# EAGLE board 000018 PGKB Rev 2.00 (EAGLE 9.6.2)
AUTHOR: Kallio Designs; DATE: 02.03.2019; PRODUCT_NUMBER: 000018; REVISION: 2.00; TITLE: PGKB
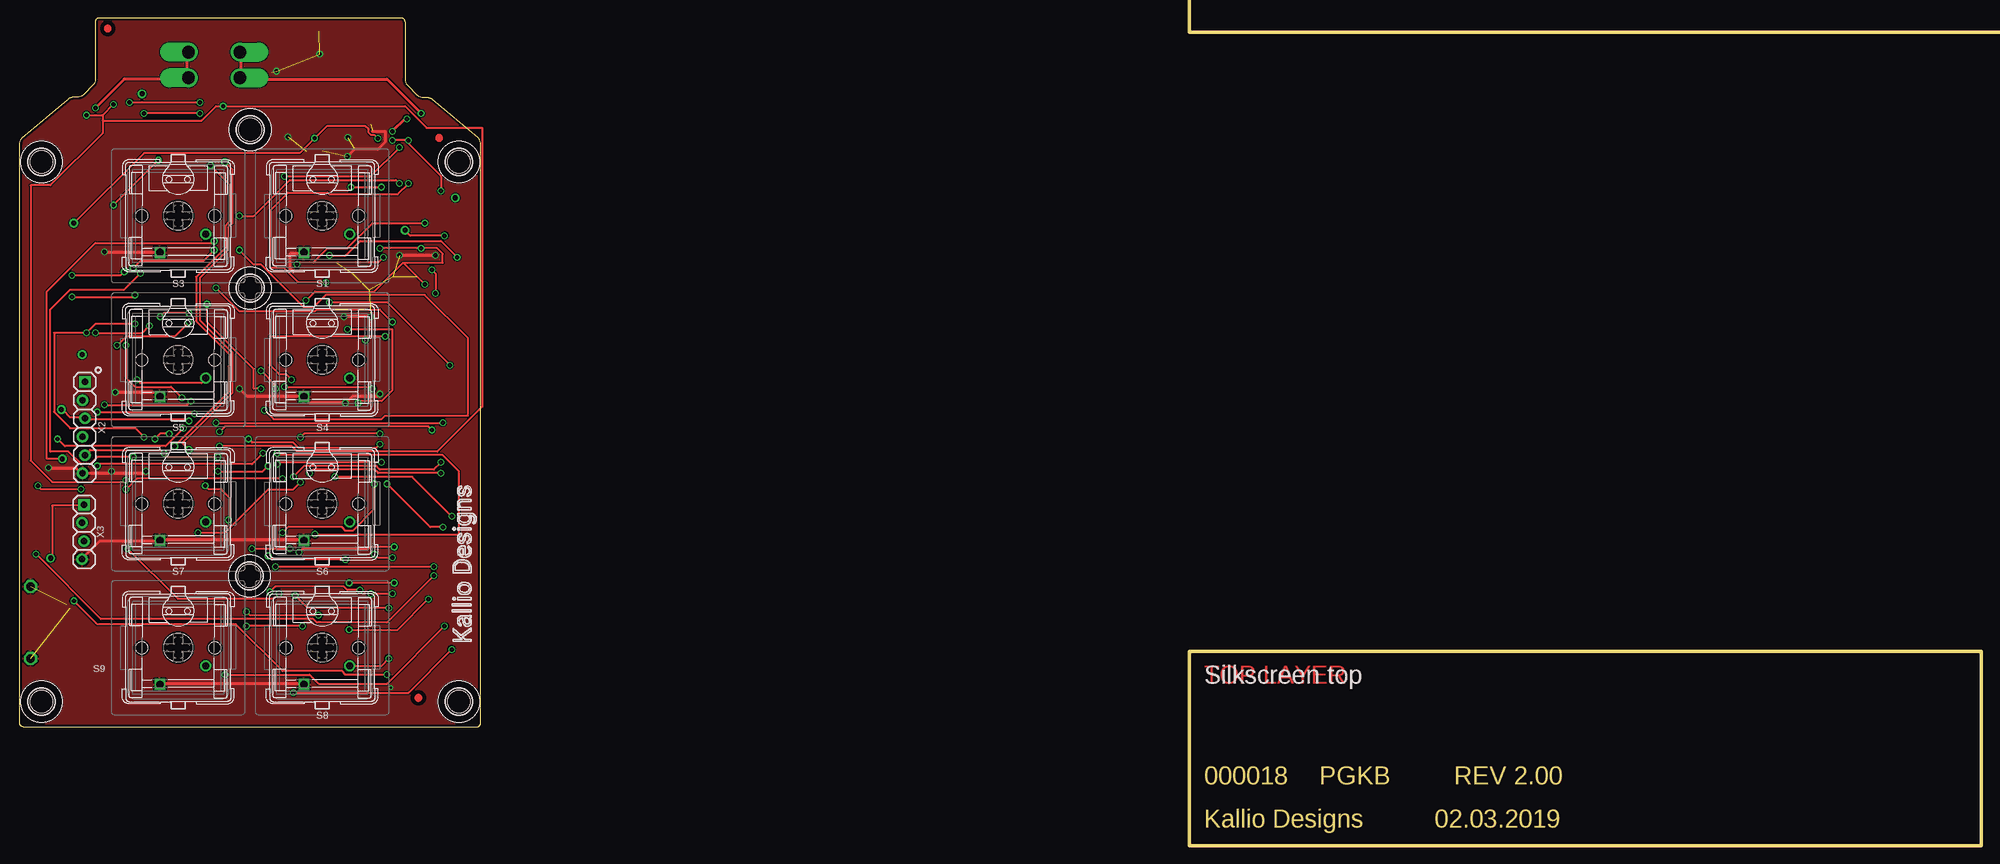
[diagram p9: board, top side]
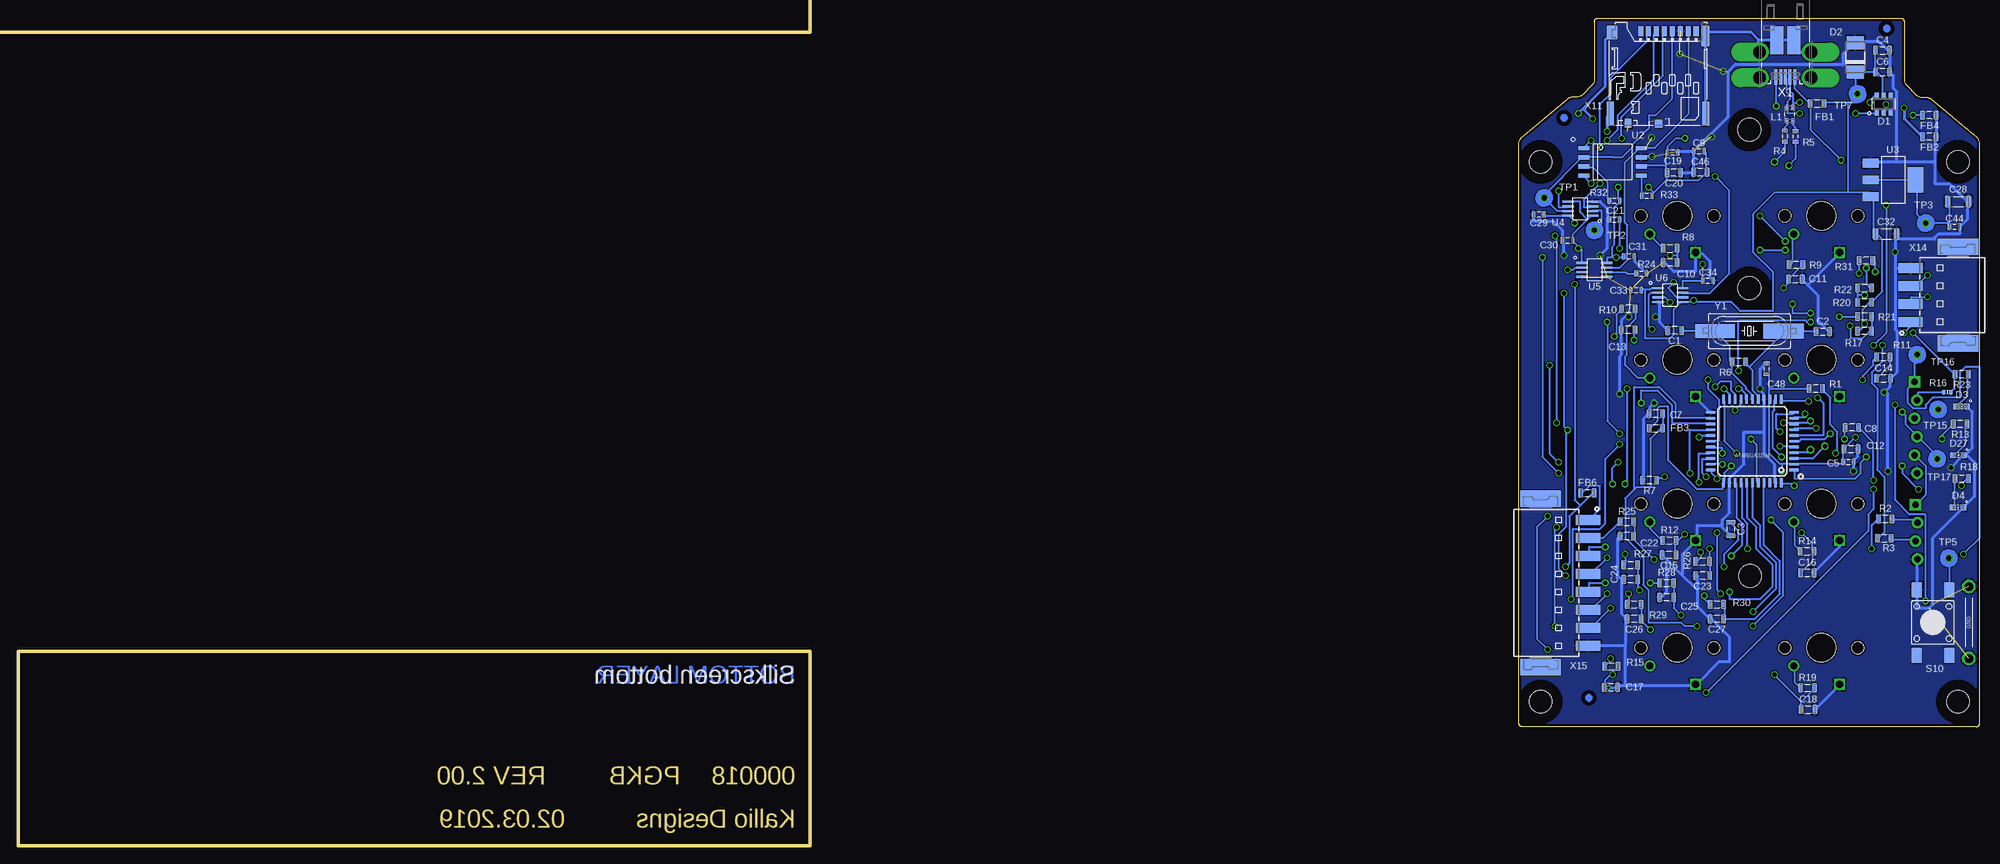
[diagram p10: board, bottom side, seen from below]

Size 272.5 x 115 mm. Coordinates in mm from the lower left corner, seen from the top.
Outline: 162.5,27 272.5,27 272.5,0 162.5,0 162.5,27
Outline: 53.5,114.5 53.5,106.5 arc45 53.85,105.65 55.15,104.35 arc45 56,104 56.5,104 arc-45 57.35,103.65 63.65,98.35 arc-45 64,97.5 64,17 arc-90 63.5,16.5 0.5,16.5 arc-90 0,17 0,97.5 arc-45 0.35,98.35 6.65,103.65 arc-45 7.5,104 8,104 arc45 8.85,104.35 10.15,105.65 arc45 10.5,106.5 10.5,114.5 arc-90 11,115 53,115 arc-90 53.5,114.5
Copper layers (1*16): Top 0.035mm / dielectric 1.5mm / Bottom 0.035mm
Design rules "ITEADstudio_DRC": minimum track width 6mil, minimum drill 12mil, track to track 6mil, track to pad 6mil, pad to pad 6mil, via to via 6mil, smd to smd 0mil, copper to edge 10mil, drill to drill 10mil, minimum pad ring 10mil, minimum via ring 6mil, stop-mask expansion 2mil, vias tented up to drill 100mil, thermal gap 10mil
Net classes: 0 default: width 0.15 mm; 1 PWR: width 0.4 mm; 2 +5V: drill 0.5 mm; 3 Serial: clearance 0.15 mm; 4 +3v3: drill 0.5 mm
Milling: 47 lines

## Footprints (pad centres in the part's own frame; a part is rotated, then mirrored left to right if it is on the bottom)
CAPC2012X160 = smd 0.7 x 1.3: P$1 -0.95,0; P$2 0.95,0
CAPC1608X90 = smd 0.5 x 0.9: P$1 -0.75,0; P$2 0.75,0
CAPC3216X200 = smd 0.9 x 1.7: P$1 -1.45,0; P$2 1.45,0
SOP95P280X120-6N = smd 0.55 x 0.8: 1 -0.95,-1.2; 2 0,-1.2; 3 0.95,-1.2; 4 0.95,1.2; 5 0,1.2; 6 -0.95,1.2
DIOC530X280X230_SMA_A = smd 1.8 x 2.4: A 2.025,0; C -2.025,0
LEDM1608X80N_DOME = smd 0.8 x 0.8: A -0.75,0; C 0.75,0
LEDM1608X80N = smd 0.8 x 0.8: A -0.75,0; C 0.75,0
RESC2012X50 = smd 0.7 x 1.3: P$1 -0.95,0; P$2 0.95,0
IND_CHOKE_EXC-34 = smd 0.75 x 0.4: A1 -0.925,0.4; A2 0.925,0.4; B1 -0.925,-0.4; B2 0.925,-0.4
RESC1608X45N = smd 0.5 x 0.9: P$1 -0.75,0; P$2 0.75,0
RESC1005X35N = smd 0.5 x 0.6: P$1 -0.5,0; P$2 0.5,0
SWITCH_BUTTON_CHERRY_MX = drill 1 square: 1 2.54,5.08 | drill 1: 2 -3.81,2.54 | hole 4: 0,0 | hole 1.7: 5.08,0; -5.08,0
SWITCH_BUTTON_TE_FSM4JSMA = smd 1.4 x 2.1: 1 2.25,4.55; 2 2.25,-4.55; 3 -2.25,4.55; 4 -2.25,-4.55
TEST_POINT_2.5MM_0.7HOLE_1SIDE = drill 0.7 pad 1.1: P$1 0,0
QFP80P1000X1000X120-44R_N = smd 1.4 x 0.45: 1 -5.8,4; 2 -5.8,3.2; 3 -5.8,2.4; 4 -5.8,1.6; 5 -5.8,0.8; 6 -5.8,0; 7 -5.8,-0.8; 8 -5.8,-1.6; 9 -5.8,-2.4; 10 -5.8,-3.2; 11 -5.8,-4; 23 5.8,-4; 24 5.8,-3.2; 25 5.8,-2.4; 26 5.8,-1.6; 27 5.8,-0.8; 28 5.8,0; 29 5.8,0.8; 30 5.8,1.6; 31 5.8,2.4; 32 5.8,3.2; 33 5.8,4 | smd 0.45 x 1.4: 12 -4,-5.8; 13 -3.2,-5.8; 14 -2.4,-5.8; 15 -1.6,-5.8; 16 -0.8,-5.8; 17 0,-5.8; 18 0.8,-5.8; 19 1.6,-5.8; 20 2.4,-5.8; 21 3.2,-5.8; 22 4,-5.8; 34 4,5.8; 35 3.2,5.8; 36 2.4,5.8; 37 1.6,5.8; 38 0.8,5.8; 39 0,5.8; 40 -0.8,5.8; 41 -1.6,5.8; 42 -2.4,5.8; 43 -3.2,5.8; 44 -4,5.8
SOP127P800X175-8 = smd 0.6 x 1.55: 1 -1.905,-4; 2 -0.635,-4; 3 0.635,-4; 4 1.905,-4; 5 1.905,4; 6 0.635,4; 7 -0.635,4; 8 -1.905,4
SOT223 = smd 1.219 x 2.235: 1 -2.311,-3.099; 2 0,-3.099; 3 2.311,-3.099 | smd 3.6 x 2.2: 4 0,3.099
SOP65P400X130-8 = smd 0.3 x 1.6: 1 -0.975,-1.7; 2 -0.325,-1.7; 3 0.325,-1.7; 4 0.975,-1.7; 5 0.975,1.7; 6 0.325,1.7; 7 -0.325,1.7; 8 -0.975,1.7
CON_USB_MICROB_UJ2-MIBH-4-SMT-TR_MAN = smd 2.2 x 0.4: D+ 8.1,0; D- 8.1,0.65; GND 8.1,-1.3; ID 8.1,-0.65; VBUS 8.1,1.3 | smd 3.9 x 1.8: G1 3,1.15; G2 3,-1.15 | drill 1.75 pad 2.2 offset: H1 8.2,3.6; H2 4.65,3.6; H3 4.65,-3.6; H4 8.2,-3.6
CON_PINHD_1X06_TH_OFFSET = drill 0.9 pad 1.6 square: 1 0.15,6.35 | drill 0.9 pad 1.6: 2 -0.15,3.81; 3 0.15,1.27; 4 -0.15,-1.27; 5 0.15,-3.81; 6 -0.15,-6.35
1X04_TH_OFFSET = drill 0.9 pad 1.6 square: 1 0.15,3.81 | drill 0.9 pad 1.6: 2 -0.15,1.27; 3 0.15,-1.27; 4 -0.15,-3.81
MTG_NP_M3_320X600 = hole 3.2: 0,0
CON_MICROSD_MOLEX_5033981892_M = smd 0.7 x 1.4: 1 4.405,-0.75; 2 5.505,-0.75; 3 6.605,-0.75; 4 7.705,-0.75; 5 8.805,-0.75; 6 9.905,-0.75; 7 11.005,-0.75; 8 12.105,-0.75 | smd 0.9 x 1.23: DET_LVR 2.66,-13.515 | smd 1.05 x 1.088: DET_SW 6.925,-13.59 | smd 1.44 x 1.83: H1 0.42,-0.915 | smd 1 x 3.33: H2 0.2,-12.165; H4 13.46,-12.165 | smd 1.16 x 2.8: H3 13.38,-1.4
PAD_GND_HOOK_M = drill 1.2 pad 1.8 octagon: P$1 -5,0; P$2 5,0
CON_PHOENIX_CONTACT_1702474 = smd 1.4 x 3.4: 1 -3.75,6.6; 2 -1.25,6.6; 3 1.25,6.6; 4 3.75,6.6 | smd 2.3 x 5.6: H1 -6.7,0; H2 6.7,0
CON_PHOENIX_CONTACT_1771088 = smd 1.4 x 3.4: 1 -8.75,6.6; 2 -6.25,6.6; 3 -3.75,6.6; 4 -1.25,6.6; 5 1.25,6.6; 6 3.75,6.6; 7 6.25,6.6; 8 8.75,6.6 | smd 2.3 x 5.6: H1 -11.7,0; H2 11.7,0
OSC_CRYSTAL_HC49/US = smd 5.6 x 2.1: 1 -4.75,0 | smd 5.5 x 2: 2 4.75,0

## Placement (x,y rotation side)
C1  C0805_18PF_50V_NP0  [CAPC2012X160]  42.39,71.59 180 bottom
C2  C0805_18PF_50V_NP0  [CAPC2012X160]  21.8,71.41 0 bottom
C3  C0805_1UF_50V_X5R  [CAPC2012X160]  34.59,43.99 270 bottom
C4  C0805_1UF_50V_X5R  [CAPC2012X160]  13.5,110.5 0 bottom
C5  C0603_100NF_50V_X7R  [CAPC1608X90]  18.25,53.3 0 bottom
C6  C0805_10NF_50V_X7R  [CAPC2012X160]  13.5,107.5 0 bottom
C7  C0805_1UF_50V_X5R  [CAPC2012X160]  45,60 180 bottom
C8  C0805_1UF_50V_X5R  [CAPC2012X160]  17.75,58.09 180 bottom
C9  C0603_100NF_50V_X7R  [CAPC1608X90]  39,96.5 0 bottom
C10  C0805_1NF_50V_X7R  [CAPC2012X160]  43,81 180 bottom
C11  C0805_1NF_50V_X7R  [CAPC2012X160]  25.59,78.73 0 bottom
C12  C0805_4.7UF_25V_X5R  [CAPC2012X160]  17.88,55.13 0 bottom
C13  C0805_1NF_50V_X7R  [CAPC2012X160]  48.83,71.67 180 bottom
C14  C0805_1NF_50V_X7R  [CAPC2012X160]  13.36,64.93 0 bottom
C15  C0805_1NF_50V_X7R  [CAPC2012X160]  43.14,40.39 180 bottom
C16  C0805_1NF_50V_X7R  [CAPC2012X160]  23.95,37.91 0 bottom
C17  C0805_1NF_50V_X7R  [CAPC2012X160]  51.24,22.01 0 bottom
C18  C0805_1NF_50V_X7R  [CAPC2012X160]  23.83,18.91 0 bottom
C19  C0603_100NF_50V_X7R  [CAPC1608X90]  42.65,96.3 180 bottom
C20  C0805_1UF_50V_X5R  [CAPC2012X160]  42.5,93.5 180 bottom
C21  C0603_100NF_50V_X7R  [CAPC1608X90]  50.75,87 0 bottom
C22  C0805_1NF_50V_X7R  [CAPC2012X160]  49,43 180 bottom
C23  C0805_1NF_50V_X7R  [CAPC2012X160]  38.5,37.5 180 bottom
C24  C0805_1NF_50V_X7R  [CAPC2012X160]  48.5,37 180 bottom
C25  C0805_1NF_50V_X7R  [CAPC2012X160]  43.5,34.5 180 bottom
C26  C0805_1NF_50V_X7R  [CAPC2012X160]  48,31.5 180 bottom
C27  C0805_1NF_50V_X7R  [CAPC2012X160]  36.5,31.5 180 bottom
C28  C1206_10UF_16V_Y5V  [CAPC3216X200]  3,89.5 0 bottom
C29  C0603_100NF_50V_X7R  [CAPC1608X90]  61.25,87.7 180 bottom
C30  C0603_100NF_50V_X7R  [CAPC1608X90]  57.25,84.1 0 bottom
C31  C0603_100NF_50V_X7R  [CAPC1608X90]  48.75,81.9 0 bottom
C32  C1206_10UF_16V_Y5V  [CAPC3216X200]  13,85 0 bottom
C33  C0603_100NF_50V_X7R  [CAPC1608X90]  47.75,77.2 0 bottom
C34  C0603_100NF_50V_X7R  [CAPC1608X90]  37.75,78.5 0 bottom
C44  C0603_100NF_50V_X7R  [CAPC1608X90]  3.5,86 0 bottom
C46  C0805_1UF_50V_X5R  [CAPC2012X160]  38.8,93.6 0 bottom
C48  C0603_100NF_50V_X7R  [CAPC1608X90]  29.6,66.25 90 bottom
D1  DIODE_TVS_5V_BI_824015  [SOP95P280X120-6N]  13.33,103.05 0 bottom
D2  DIODE_TVS_5V_SMAJ5.0A  [DIOC530X280X230_SMA_A]  17.28,109.52 90 bottom
D3  LED_0603_GREEN_CLEAR_APTD1608CGCK  [LEDM1608X80N_DOME]  2.5,61 0 bottom
D4  LED_0603_AMBER_DIFF_LOQ976-PS-25  [LEDM1608X80N]  3,47 0 bottom
D27  LED_0603_AMBER_DIFF_LOQ976-PS-25  [LEDM1608X80N]  2.94,54.25 0 bottom
ENCLOSURE1  ENCLOSURE_BOPLA_BOP-500-9005-TOP  [ENCLOSURE_BOPLA_BOP-500-9005]  32,57.5 180 top
FB1  FERRITE_0805_0A5  [RESC2012X50]  22.59,103.13 0 bottom
FB2  FERRITE_0805_0A5  [RESC2012X50]  7,98.5 180 bottom
FB3  FERRITE_0805_0A5  [RESC2012X50]  45,58 0 bottom
FB4  FERRITE_0805_0A5  [RESC2012X50]  7,101.5 180 bottom
FB6  FERRITE_0805_0A5  [RESC2012X50]  54.5,49 0 bottom
FIDUCIAL1  FIDUCIAL  [FIDUCIAL]  12.91,113.53 0 bottom
FIDUCIAL2  FIDUCIAL  [FIDUCIAL]  55.37,20.53 0 top
FIDUCIAL3  FIDUCIAL  [FIDUCIAL]  57.73,101.13 0 bottom
FIDUCIAL4  FIDUCIAL  [FIDUCIAL]  54.29,20.53 0 bottom
FIDUCIAL5  FIDUCIAL  [FIDUCIAL]  58.25,98.33 0 top
FIDUCIAL6  FIDUCIAL  [FIDUCIAL]  12.21,113.53 0 top
H1  SWITCH_CAP_DSA_RELEG  [SWITCH_CAP_DSA_RELEG]  22,67.5 180 top
H2  SWITCH_CAP_DSA_RELEG  [SWITCH_CAP_DSA_RELEG]  42,67.5 180 top
H3  SWITCH_CAP_DSA_RELEG  [SWITCH_CAP_DSA_RELEG]  42,87.5 180 top
H4  SWITCH_CAP_DSA_RELEG  [SWITCH_CAP_DSA_RELEG]  42,47.5 180 top
H5  SWITCH_CAP_DSA_RELEG  [SWITCH_CAP_DSA_RELEG]  42,27.5 180 top
H6  SWITCH_CAP_DSA_RELEG  [SWITCH_CAP_DSA_RELEG]  22,27.5 180 top
H7  SWITCH_CAP_DSA_RELEG  [SWITCH_CAP_DSA_RELEG]  22,87.5 180 top
H8  SWITCH_CAP_DSA_RELEG  [SWITCH_CAP_DSA_RELEG]  22,47.5 180 top
L1  L_CHOKE_EXC-34CE670U  [IND_CHOKE_EXC-34]  26.35,101.63 90 bottom
LOGO2  ART_LOGO_TEXT_2.5MM-SILK  [ART_LOGO_TEXT_2.5MM_SILK]  61.48,39.56 90 top
R1  R0805_10K_5%  [RESC2012X50]  22.76,63.49 180 bottom
R2  R0805_1K_1%  [RESC2012X50]  13.13,45.41 0 bottom
R3  R0805_1K_1%  [RESC2012X50]  13.26,42.72 0 bottom
R4  R0603_22  [RESC1608X45N]  27.08,98.58 270 bottom
R5  R0603_22  [RESC1608X45N]  25.58,98.54 270 bottom
R6  R0805_1M_5%  [RESC2012X50]  33.45,67.22 0 bottom
R7  R0805_10K_5%  [RESC2012X50]  45.86,50.78 180 bottom
R8  R0805_200_1%  [RESC2012X50]  43,83 0 bottom
R9  R0805_200_1%  [RESC2012X50]  25.52,80.72 0 bottom
R10  R0805_200_1%  [RESC2012X50]  48.79,74.59 180 bottom
R11  R0805_200_1%  [RESC2012X50]  13.4,67.91 0 bottom
R12  R0805_200_1%  [RESC2012X50]  43.09,42.41 0 bottom
R13  R0805_1K_1%  [RESC2012X50]  2.72,58.59 180 bottom
R14  R0805_200_1%  [RESC2012X50]  23.97,40.91 0 bottom
R15  R0805_200_1%  [RESC2012X50]  51.16,24.91 0 bottom
R16  R0402_DNP  [RESC1005X35N]  4.5,63 0 bottom
R17  R0805_3K3_1%  [RESC2012X50]  16,71.5 180 bottom
R18  R0805_1K_1%  [RESC2012X50]  2.5,51 0 bottom
R19  R0805_200_1%  [RESC2012X50]  23.92,21.91 0 bottom
R20  R0805_3K3_1%  [RESC2012X50]  16,75.5 0 bottom
R21  R0805_200_1%  [RESC2012X50]  16,73.5 180 bottom
R22  R0805_200_1%  [RESC2012X50]  16,77.5 0 bottom
R23  R0805_1K_1%  [RESC2012X50]  2.5,65.5 180 bottom
R24  R0603_0  [RESC1608X45N]  47,79.5 0 bottom
R25  R0805_1K_1%  [RESC2012X50]  49,45 0 bottom
R26  R0805_1K_1%  [RESC2012X50]  38.5,39.5 0 bottom
R27  R0805_1K_1%  [RESC2012X50]  48.5,39 0 bottom
R28  R0805_1K_1%  [RESC2012X50]  43.5,36.5 0 bottom
R29  R0805_1K_1%  [RESC2012X50]  48,33.5 0 bottom
R30  R0805_1K_1%  [RESC2012X50]  36.5,33.5 0 bottom
R31  R0805_200_1%  [RESC2012X50]  15.8,81.3 180 bottom
R32  R0603_0  [RESC1608X45N]  50.75,89.6 0 bottom
R33  R0603_0  [RESC1608X45N]  46.25,90.3 0 bottom
S1  SWITCH_BUTTON_MX1A-C1NW  [SWITCH_BUTTON_CHERRY_MX]  42,87.5 180 top
S3  SWITCH_BUTTON_MX1A-C1NW  [SWITCH_BUTTON_CHERRY_MX]  22,87.5 180 top
S4  SWITCH_BUTTON_MX1A-C1NW  [SWITCH_BUTTON_CHERRY_MX]  42,67.5 180 top
S5  SWITCH_BUTTON_MX1A-C1NW  [SWITCH_BUTTON_CHERRY_MX]  22,67.5 180 top
S6  SWITCH_BUTTON_MX1A-C1NW  [SWITCH_BUTTON_CHERRY_MX]  42,47.5 180 top
S7  SWITCH_BUTTON_MX1A-C1NW  [SWITCH_BUTTON_CHERRY_MX]  22,47.5 180 top
S8  SWITCH_BUTTON_MX1A-C1NW  [SWITCH_BUTTON_CHERRY_MX]  42,27.5 180 top
S9  SWITCH_BUTTON_MX1A-C1NW  [SWITCH_BUTTON_CHERRY_MX]  22,27.5 180 top
S10  SWITCH_MOM_SPST_FSM4JSMA  [SWITCH_BUTTON_TE_FSM4JSMA]  6.5,31 0 bottom
TP1  PAD_TEST_POINT-2.5/0.7_A  [TEST_POINT_2.5MM_0.7HOLE_1SIDE]  60.5,90 0 bottom
TP2  PAD_TEST_POINT-2.5/0.7_A  [TEST_POINT_2.5MM_0.7HOLE_1SIDE]  53.5,85.5 0 bottom
TP3  PAD_TEST_POINT-2.5/0.7_A  [TEST_POINT_2.5MM_0.7HOLE_1SIDE]  7.5,86.5 180 bottom
TP5  PAD_TEST_POINT-2.5/0.7_A  [TEST_POINT_2.5MM_0.7HOLE_1SIDE]  4.28,39.94 90 bottom
TP7  PAD_TEST_POINT-2.5/0.7_A  [TEST_POINT_2.5MM_0.7HOLE_1SIDE]  16.97,104.45 270 bottom
TP15  PAD_TEST_POINT-2.5/0.7_A  [TEST_POINT_2.5MM_0.7HOLE_1SIDE]  5.78,60.6 270 bottom
TP16  PAD_TEST_POINT-2.5/0.7_A  [TEST_POINT_2.5MM_0.7HOLE_1SIDE]  8.68,68.22 0 bottom
TP17  PAD_TEST_POINT-2.5/0.7_A  [TEST_POINT_2.5MM_0.7HOLE_1SIDE]  5.92,53.74 270 bottom
U1  IC_MCU_ATMEGA32U4-AU  [QFP80P1000X1000X120-44R_N]  31.56,56.19 180 bottom
U2  IC_MEM_FLASH_AT45DB321E  [SOP127P800X175-8]  51,95 270 bottom
U3  IC_REG_3V3_1A_NCP1117LPST33T3G  [SOT223]  12,92.5 270 bottom
U4  IC_LEVEL_SHIFTER_SN74LVC2T45  [SOP65P400X130-8]  55.5,88.5 90 bottom
U5  IC_LEVEL_SHIFTER_SN74LVC2T45  [SOP65P400X130-8]  53.5,80 270 bottom
U6  IC_LEVEL_SHIFTER_SN74LVC2T45  [SOP65P400X130-8]  43,76.5 270 bottom
X1  CON_USB_MICROB_UJ2-MIBH-4-SMT-TR-MAN  [CON_USB_MICROB_UJ2-MIBH-4-SMT-TR_MAN]  27,114.9 270 bottom
X2  CON_PROG_AVR_ISP-OFFSET_1X06  [CON_PINHD_1X06_TH_OFFSET]  8.88,58.08 0 top
X3  CON_1X04_TH_OFFSET_PADS-SILK  [1X04_TH_OFFSET]  8.79,43.59 0 top
X4  HOL_3.2/6.0_NP  [MTG_NP_M3_320X600]  61,20 180 top
X6  HOL_3.2/6.0_NP  [MTG_NP_M3_320X600]  3,95 180 top
X9  HOL_3.2/6.0_NP  [MTG_NP_M3_320X600]  3,20 180 top
X10  HOL_3.2/6.0_NP  [MTG_NP_M3_320X600]  61,95 180 top
X11  CON_MICROSD_MOLEX_5033981892-M  [CON_MICROSD_MOLEX_5033981892_M]  51.5,113.9 0 bottom
X12  HOL_3.2/6.0_NP  [MTG_NP_M3_320X600]  32,99.5 180 top
X13  PAD_TEST_GROUND_HOOK  [PAD_GND_HOOK_M]  1.5,31 90 bottom
X14  CON_CLAMP_PTSM_1X04_H_SMD  [CON_PHOENIX_CONTACT_1702474]  3,76.5 90 bottom
X15  CON_CLAMP_PTSM_1X08_H_SMD  [CON_PHOENIX_CONTACT_1771088]  61,36.5 270 bottom
X17  HOL_3.2/6.0_NP  [MTG_NP_M3_320X600]  31.9,37.48 180 top
X18  HOL_3.2/6.0_NP  [MTG_NP_M3_320X600]  31.98,77.48 180 top
Y1  OSC_CRYSTAL_16M_ABLS-16.000MHZ-B4-T-HC49  [OSC_CRYSTAL_HC49/US]  32,71.5 180 bottom

## Tracks (layer width: path | path; a pad name or v marks a point on that pad's centre or on a via)
!CS!_FLASH_3V3  (via drill 0.61)
  Top 0.254: v54,92 52.5,90.5 43,90.5 42.75,90.75 37.25,90.75 34.75,88.25 34.75,80.25 36.75,80.25 38.75,78.25 v42.5,78.25
  Bottom 0.254: U6.6 42.07,76.17 43,77.11 43,77.19 43.28,77.47 v42.5,78.25 | v54,92 55,93 U2.4
!CS!_FLASH_5V  (via drill 0.61)
  Top 0.254: v38,51.25 39.5,52.75 49.5,52.75 50,52.25 57.5,52.25 v58.5,53.25 | v59.75,66.75 51,75.5 v43,75.5
  Bottom 0.254: v38,51.25 38.5,51.75 38.5,53.75 37.5,53.75 U1.31 | v58.5,53.25 59.75,54.5 v59.75,66.75 | v43,75.5 43.75,76.25 44.5,76.25 U6.3
!CS!_SD_3V3  (via drill 0.61)
  Top 0.254: v52.75,97 48.75,93 v36.75,93
  Bottom 0.254: v52.75,97 52.75,103 51.25,104.5 51.25,106.75 46.25,111.75 46.25,112.75 46,113 X11.2 | v36.75,93 34.75,91 34.75,79.5 37.5,76.75 41.25,76.75 U6.7
!CS!_SD_5V  (via drill 0.61)
  Top 0.254: v47,61.5 47.25,61.75 50.25,61.75 51.75,63.25 51.75,71.75 v45.5,71.75
  Bottom 0.254: v47,61.5 47,63.25 44.75,63.25 42.75,61.25 42.75,58.75 37.5,58.75 U1.25 | v45.5,71.75 46,72.25 46,76.5 45.75,76.75 44.75,76.75 U6.2
!RESET  (via drill 0.61)
  Top 0.254: TP5.P$1 4.5,40 4.5,47.25 8.75,47.25 X3.1 | X2.5 9.25,54.5 9.75,55 19.5,55 v20,54.5 20.5,54 v27.5,54
  Bottom 0.254: S10.1 4.25,39.75 TP5.P$1 | v20,54.5 19.75,54.75 19.75,57.5 20.75,58.5 20.75,62.25 21.75,63.25 R1.P$1 | v27.5,54 28.75,55.25 28.75,60.25 28.5,60.5 28.5,61.75 U1.13 | X3.1 8.75,47.5 7.5,48.75 7.5,52.75 9,54.25 X2.5
!RESET!_3V3
  Bottom 0.254: R32.P$1 51.5,89.75 51.75,90 51.75,92.25 53.75,94.25 55,94.25 U2.3
+3V3  (via drill 0.61)
  Top 0.254: v38.5,80.75 38.75,81 40.75,81 | 40.75,81 49.75,81 v50.5,81.75 | v56.25,86.5 49,86.5 45.5,83 42.75,83 40.75,81 | TP3.P$1 17.25,96.25 38.9,96.25 v40.95,98.3 42.65,100 48,100 48.47,99.53 48.47,99.03 48.78,98.72 49.28,98.72 v49.75,98.25 | v46,91.5 v50.25,91.5
  Bottom 0.254: C29.P$1 60.5,87.5 57.25,87.5 U4.8 57,87.5 56.25,86.75 v56.25,86.5 | U6.8 41.25,77.5 41.25,78.5 C34.P$1 v38.5,80.75 | 51,81.75 51.75,81.75 51.75,81 U5.8 | 51,81.75 v50.5,81.75 49.5,81.75 C31.P$1 | 51,81.75 51,83.25 50.75,83.5 50.75,88.75 50,89.5 R32.P$2 50,89.75 50.25,90 v50.25,91.5 | 4.25,86.5 4.25,89.5 C28.P$1 | 4.25,86.5 C44.P$1 | 4.25,86.5 TP3.P$1 8.75,87.75 8.75,92.5 U3.4 U3.2 | C9.P$2 38,96.25 38,93.75 C46.P$2 38,93.5 39,92.5 43.5,92.5 | 43.5,93.5 43.5,94.5 | 43.5,94.5 43.5,96.25 C19.P$2 43.4,97.1 42.2,98.3 v40.95,98.3 | 43.5,92.5 45.25,90.75 | 45.25,90.75 45.5,90.5 R33.P$2 | 43.5,93.5 43.5,92.5 | 43.5,93.5 C20.P$2 | v49.75,98.25 49.75,101.25 44,107 44,113 X11.4 | 43.5,94.5 47,94.5 U2.6 | 45.25,90.75 v46,91.5
+5V  (via drill 0.61)
  Top 0.254: v34.5,52.75 33.75,52 v27.5,52 | v57.5,38.75 v35.5,38.75 | v50,83 v55.75,83 58,83 58.75,82.25 58.75,81 53.25,81 | v16,72.5 10.5,72.5 v9.25,71.25 4.75,71.25 4.75,60.25 7,58 16,58 v17.25,56.75 | 53.25,81 49.25,77 41,77 v39.75,75.75 | 53.25,81 v56.25,78
  Bottom 0.254: FB3.P$1 45.75,58 44.75,59 44.75,60.75 44.5,61 43.25,61 43.25,53.5 39.25,49.5 35.75,49.5 35.75,50.25 U1.34 35.5,50.5 35.5,51.75 v34.5,52.75 | 29.25,63.5 29.25,62 U1.14 29.25,61.75 29.25,54.5 27.75,53 27.5,53 | 29.25,63.5 29.25,65.25 29.5,65.5 C48.P$1 | 29.25,63.5 23.75,63.5 R1.P$2 | 27.5,53 26,53 U1.2 19,53 C5.P$1 19,55 C12.P$1 18.75,55.25 v17.25,56.75 | 27.5,53 v27.5,52 | v35.5,38.75 35.5,40.5 33.5,42.5 33.5,43.75 34.5,44.75 C3.P$1 | v57.5,38.75 57,39.25 57,45.75 55.5,47.25 | 55.5,47.25 53.75,49 FB6.P$2 | 55.5,83 55.25,82.75 55.25,81 U5.1 | 55.5,83 56.5,84 C30.P$2 56.5,85 54.5,87 | v50,83 C21.P$2 | 55.5,83 v55.75,83 | 54.5,87 54,87.5 U4.1 | 54.5,87 55.5,88 55.5,89.5 57,89.5 U4.5 | 18.25,103.25 17,103.25 17,104.25 TP7.P$1 17,104.5 17.25,104.75 17.25,107.25 D2.C 17.25,107.5 14.5,107.5 | 18.25,103.25 21.5,103.25 FB1.P$2 | D1.5 13.5,104.25 13.5,106.75 14.25,107.5 C6.P$1 14.5,107.5 | 14.5,107.5 14.5,110.5 C4.P$1 | 46.5,77.25 45.75,77.25 45.5,77.5 44.75,77.5 U6.1 | 46.5,77.25 47,77.25 C33.P$2 | 46.5,77.25 46.5,70.5 43,70.5 42.5,71 42.5,74.5 41.5,75.5 U6.5 41.25,75.5 39.75,75.5 | R16.P$2 3.5,63.5 3.5,65.5 | 16.25,72.5 16.25,72 16.75,71.5 R17.P$2 | 16.25,72.5 16.25,74.5 15.25,75.5 R20.P$2 15,75.5 13.5,77 13.5,84.25 14.25,85 C32.P$1 14.5,85 14.75,85.25 14.75,89.75 15,90 U3.3 15.25,90.25 15.25,90.75 18.25,90.75 | v9.25,71.25 3.5,65.5 | 16.25,72.5 v16,72.5 | 3.5,65.5 R23.P$2 | 39.75,75.5 34.5,75.5 33.25,74.25 28.75,74.25 28.75,79.75 31.5,82.5 31.5,87.75 28.5,90.75 18.25,90.75 | 18.25,90.75 18.25,103.25 | 39.75,75.5 v39.75,75.75 | 55.5,47.25 56.25,48 v56.25,78
AD0  (via drill 0.61)
  Top 0.254: v34.5,40.25 35,39.75 v45.25,39.75
  Bottom 0.254: 48,43 48,45 R25.P$2 | v34.5,40.25 33,41.75 33,44.75 33.75,45.5 33.75,50.25 U1.36 | v45.25,39.75 48,42.5 48,43 | 48,43 C22.P$1
AD1  (via drill 0.61)
  Top 0.254: v37.5,41.25 v32.25,41.25
  Bottom 0.254: 37.5,39.5 37.5,37.5 C23.P$1 | v32.25,41.25 32.25,44.75 33,45.5 33,50.25 U1.37 | 37.5,39.5 v37.5,41.25 | 37.5,39.5 R26.P$2
AD4  (via drill 0.61)
  Top 0.254: v34.75,35.25 35.5,36 45,36 45.5,35.5 v47.25,35.5
  Bottom 0.254: 47.5,37 47.5,39 R27.P$2 | v34.75,35.25 34.75,34.25 30.5,34.25 28.75,36 28.75,39 31,41.25 31,44.25 32.25,45.5 32.25,50.25 U1.38 | v47.25,35.5 47.5,35.75 47.5,37 | 47.5,37 C24.P$1
AD5  (via drill 0.61)
  Top 0.254: v31.5,32.5 32,32 v41.5,32
  Bottom 0.254: 42.5,34.5 42.5,36.5 R28.P$2 | v31.5,32.5 28.25,35.75 28.25,39.25 30.5,41.5 30.5,44.5 31.5,45.5 31.5,50.25 U1.39 | v41.5,32 42.5,33 42.5,34.5 | 42.5,34.5 C25.P$1
AD6  (via drill 0.61)
  Top 0.254: v31.75,56.5 32.25,56 38,56 38.75,55.25 49.5,55.25 v50,55.75 | v56.75,34.25 52.5,30 v45.75,30
  Bottom 0.254: 47,31.5 47,33.5 R29.P$2 | v31.75,56.5 31,55.75 31,50.75 30.75,50.5 U1.40 | v50,55.75 52,53.75 52,44.75 52.75,44 56.5,44 56.5,34.5 v56.75,34.25 | v45.75,30 47,31.25 47,31.5 | 47,31.5 C26.P$1
AD7
  Bottom 0.254: 35.5,31.5 35.5,33.5 R30.P$2 | 35.5,31.5 31.25,31.5 27.75,35 27.75,39.5 30,41.75 30,50.25 U1.41 | 35.5,31.5 C27.P$1
BUTTON1  (via drill 0.61)
  Top 0.254: v40.25,51.75 40.75,52.25 49.25,52.25 49.75,51.75 v58.5,51.75 | v60.75,81.75 58.5,84 47.25,84 45.25,82 v43,82
  Bottom 0.254: 42,82 42,83 R8.P$2 | 42,82 42,81 C10.P$1 | v40.25,51.75 40.25,57.75 37.5,57.75 U1.26 | v58.5,51.75 60.75,54 v60.75,81.75 | 42,82 v43,82
BUTTON2  (via drill 0.61)
  Top 0.254: v39,56.75 39.5,57.25 v50,57.25 | v51.75,72.75 50,74.5 41.25,74.5 41,74.25 30.5,74.25 v27.25,77.5
  Bottom 0.254: R9.P$2 24.75,80.5 26.5,78.75 C11.P$1 26.75,78.5 26.75,78 v27.25,77.5 | v39,56.75 39,57 37.5,57 U1.27 | v50,57.25 51.75,59 v51.75,72.75
BUTTON3  (via drill 0.61)
  Top 0.254: 48.5,70.75 v48,70.25 | v50.75,70.75 48.5,70.75 | v37.75,64.75 37,65.5 36,65.5 34.75,66.75 34.75,70.75 48.5,70.75
  Bottom 0.254: v48,70.25 48,71.5 C13.P$1 | v50.75,70.75 50.5,71 50.5,73.75 49.75,74.5 R10.P$2 | v37.75,64.75 37.75,63.5 36.25,62 36.25,56.25 37.25,56.25 U1.28
BUTTON4
  Bottom 0.254: C14.P$1 14.25,65 12.5,66.75 12.5,67.75 R11.P$2
BUTTON5  (via drill 0.61)
  Top 0.254: v35.75,54.5 36,54.25 58.75,54.25 61,52 61,43.25 v41,43.25
  Bottom 0.254: C15.P$1 42.25,40.5 42.25,42.25 R12.P$2 42,42.25 v41,43.25 | v35.75,54.5 35.75,55.25 37.25,55.25 U1.29
BUTTON6  (via drill 0.61)
  Top 0.254: v39,50.5 38,49.5 34.5,49.5 28.5,43.5 v24.75,43.5
  Bottom 0.254: C16.P$1 24.75,38 23.25,39.5 23.25,40.75 R14.P$2 23.25,41 23.25,42 v24.75,43.5 | v39,50.5 39,54.5 37.5,54.5 U1.30
BUTTON7  (via drill 0.61)
  Top 0.254: v23.75,61.75 23.25,61.25 v11.75,61.25 | v7.5,34 10.75,30.75 30,30.75 36.5,24.25 44.75,24.25 45.25,23.75 v51,23.75
  Bottom 0.254: 51,24 52,23 52,22.25 C17.P$1 | 51,24 50.25,24.75 R15.P$2 | v23.75,61.75 27.5,61.75 U1.12 | v11.75,61.25 11.75,48 9.75,46 7.5,46 v7.5,34 | 51,24 v51,23.75
BUTTON8  (via drill 0.61)
  Top 0.254: v35.75,53 36,53.25 v50.25,53.25 | v51,50.25 57,44.25 v58.75,44.25 | v59,30.5 51,22.5 41.5,22.5 40.25,23.75 v28.5,23.75
  Bottom 0.254: 24.75,20 23,21.75 R19.P$2 | 24.75,20 24.75,19 C18.P$1 | v35.75,53 37.25,53 U1.32 | v50.25,53.25 51,52.5 v51,50.25 | v58.75,44.25 59,44 v59,30.5 | 24.75,20 v28.5,23.75
CLK_3V3
  Bottom 0.254: X11.5 42.7,103.82 45.01,101.5 45.9,101.5 45.9,99.7 46.06,99.54 46.2,99.54 46.69,99.05 46.69,98.91 47.5,98.1 47.6,98.1 48.2,97.5 48.2,97.1 49.66,95.64 50.88,95.64 51,95.64 U2.2 55.27,95.64 60.5,90.41 TP1.P$1 58.67,88.17 U4.7
CLK_5V  (via drill 0.61)
  Top 0.254: v23.5,59 23.25,59.25 9.25,59.25 X2.3 9,59.5 7,59.5 6,60.5 TP15.P$1 | TP2.P$1 54.25,84.75 v59,84.75 | v27.25,58.75 v58.75,58.75
  Bottom 0.254: TP2.P$1 52.5,86.5 52.5,88.25 53.75,88.25 U4.2 | v23.5,59 23.5,58.75 25.75,58.75 U1.9 26,58.75 v27.25,58.75 | v59,84.75 58.75,84.5 v58.75,58.75
GND  (via drill 0.35, 0.61)  (15 unrouted)
  Top 0.4: v13.25,63 18.75,63 19.25,62.5 S5.1 | v11.75,82.5 19.25,82.5 S3.1 | v45.5,95.75 46.5,96.75 49.75,96.75 50.75,97.75 50.75,99.25 49,99.25 | S9.1 19.5,22.5 39.25,22.5 S8.1 | v17.5,52 17.25,51.75 12.75,51.75 | 12.75,51.75 8.75,51.75 X2.6 8.5,51.75 7.75,52.5 v4,52.5 | X3.4 8.75,40 11,42.25 19.25,42.25 S7.1 19.5,42.5 39.25,42.5 S6.1 | 38,79.75 37.5,80.25 37.5,82.25 39.25,82.25 S1.1 | v48.75,73.5 v45,73.5 | v57.75,82 v52.75,82 | v30.5,63.5 31.5,62.5 39.25,62.5 S4.1 39.5,62.25 40.25,61.5 v45.25,61.5 46.25,62.5 49.75,62.5 v50,62.75 | 12.75,51.75 v12.75,52
  Bottom 0.4: 23.88,77.88 24.5,78.5 C11.P$2 | 23.88,77.88 22.5,76.5 22.5,73 21,71.5 C2.P$2 | 23.88,77.88 19.5,82.25 S3.1 | 11.75,84.25 11.75,85 C32.P$2 11.75,84.25 | 11.75,84.25 v11.75,82.5 11.75,80.25 | 11.75,80.25 11.75,71.75 11.5,71.5 11.5,65.75 12.25,65 C14.P$2 12.5,64.75 12.5,63.75 v13.25,63 13,63 12.75,62.75 v12.75,52 | 11.75,80.25 X14.4 | C20.P$1 39.75,93.5 C46.P$1 C9.P$1 | C9.P$1 41.75,96.5 C19.P$1 42,96.5 | 37,98.25 v37.25,98.5 | 48.75,100.25 X11.DET_LVR | v45.5,95.75 47,95.75 U2.7 | 12.5,107.5 12.5,110.5 C4.P$2 12.75,110.5 14,111.75 17.25,111.75 D2.A 17.5,111.5 19,110 19,108.5 34,108.5 35,107.5 35,101.25 C9.P$1 | 1.75,89.5 1.75,87 C44.P$2 2.75,85 5.75,85 6.25,84.5 6.25,84.25 11.75,84.25 | FB4.P$1 6,101.5 6,98.5 FB2.P$1 6.25,98.5 6.25,95 | 6.25,95 11.5,95 | 11.5,95 15,95 U3.1 | 1.75,89.5 4.25,92 6.25,92 6.25,95 | 1.75,89.5 C28.P$2 | 12.5,107.5 12,107 12,105.25 11.5,104.75 11.5,95 | 12.5,107.5 C6.P$2 | C22.P$2 50,43 50.25,42.75 50.25,37.5 49.75,37 C24.P$2 49.5,37 49.75,36.75 49.75,32.25 49,31.5 C26.P$2 49.25,31.5 49.25,27.75 | 49.25,27.75 X15.8 | C18.P$2 22.75,19 19.5,22.25 S9.1 | 50.25,22 C17.P$2 | 49.25,22.25 50.25,22.25 C17.P$2 | 49.25,22.25 39.5,22.25 S8.1 39.25,22.5 36.25,25.5 34.75,25.5 34.75,29 37.25,31.5 C27.P$2 37.5,31.5 39.25,33.25 39.25,35.5 | v51.55,21.95 C17.P$2 | 49.25,22.25 49.25,27.75 | C12.P$2 17,55 17,54 17.5,53.5 C5.P$2 v17.5,52 | D3.C 1,60.25 1,55.25 1.88,54.38 | 1.88,54.38 2,54.25 D27.C 2.25,54.25 v4,52.5 | 1.88,54.38 0.75,53.25 0.75,48.5 D4.C 6.5,42.75 6.5,33.5 7,33 8.75,33 S10.3 8.75,39.75 X3.4 | C16.P$2 23,38 19.5,41.5 19.5,42.25 S7.1 | R24.P$2 48,81.25 C31.P$2
  Bottom 0.4: 51.62,87.12 51.75,87.25 51.75,88.5 52.75,89.5 53.75,89.5 U4.4 | 51.62,87.12 C21.P$1 | C34.P$2 37.5,79 37.5,81.25 38.5,82.25 39.25,82.25 S1.1 39.5,82.25 39.5,79.75 42.5,79.75 43.75,81 C10.P$2 | v52.75,82 51.75,83 51.75,87 51.62,87.12 | C29.P$2 62,86.75 59.25,86.75 58,85.5 C30.P$1 58,84 57.75,83.75 v57.75,82 | C1.P$2 44.5,72.75 44.5,73.5 | 44.5,73.5 44.5,75.5 U6.4 | 48.75,74 48.88,73.88 | 48.88,73.88 49.75,73 49.75,71.75 C13.P$2 49.75,71.5 49.75,68.25 50,68 v50,62.75 | v45,73.5 44.5,73.5 | v48.75,73.5 48.75,73.75 48.88,73.88 | U1.23 37.5,60.25 39.25,62 39.25,62.25 S4.1 | R7.P$2 46.75,51 46.75,59.25 46,60 C7.P$2 45.75,60 45.75,61 v45.25,61.5 | C48.P$2 29.75,67 30.5,66.25 v30.5,63.5 30.5,63.25 30,62.75 30,62 U1.15 30,61.75 30,57.5 | 30,57.5 30,54.5 28.5,53 28.5,50.5 U1.43 | 35.88,44.38 36,44.5 39.25,44.5 39.25,42.5 S6.1 39.5,42.25 41.25,40.5 41.25,37.75 41.38,37.62 | 35.88,44.38 34.75,43.25 C3.P$2 | 35.88,44.38 35.75,44.5 35.75,45.25 34.75,46.25 34.75,50.25 U1.35 34.75,50.5 34.75,51 32.75,53 32.75,57.5 30,57.5 | 39.25,35.5 39.25,37.5 C23.P$2 | 39.25,35.5 41.38,37.62 | 41.38,37.62 43.38,39.62 | 43.38,39.62 44,40.25 C15.P$2 | C25.P$2 44.25,34.5 43.5,35.25 43.5,39.5 43.38,39.62
  other vias: 35.65,107.6 45.55,98.4 41.65,110
  pour Bottom: -26,126 -33.5,79.5 -28,-1 91,-10 101,45 84,124 -19,128 -23.5,128 -24,128
  pour Top: -21,124 -28.5,77.5 -23,-3 96,-12 106,43 89,122 -14,126 -18.5,126 -19,126
GND_E  (via drill 0.61)
  Top 0.4: v10.5,102.5 14.5,106.5 23.25,106.5 X1.H1 23.25,106.75 23.25,110.25 X1.H2 | v55.75,101.75 51,106.5 30.75,106.5 X1.H4 30.75,106.75 30.75,110.25 X1.H3 | v51.75,99.25 53.5,101 v53.75,101
  Bottom 0.4: v10.5,102.5 10.5,101 8,98.5 FB2.P$2 | 30.75,112 30.75,110.25 X1.H3 | 30.75,112 28.25,112 X1.G2 28,112 26,112 X1.G1 25.75,111.75 25.75,110.25 X1.H2 | v55.75,101.75 55.12,102.38 | 55.12,102.38 52,105.5 52,112 51.25,112.75 X11.H1 | v51.75,99.25 51.75,101.25 51.5,101.5 X11.H2 | 55.12,102.38 v53.75,101 | 30.75,112 31.75,113 37.62,113 X11.H3 38.04,112.42 X11.H4
INTERRUPT7  (via drill 0.61)
  Top 0.254: v16.75,79.5 14.5,77.25 7,77.25 4.25,74.5 4.25,54.75 6.75,54.75 8.5,53 9.75,53 10.75,54 v15.75,54
  Bottom 0.254: v16.75,79.5 R31.P$2 | v15.75,54 16.5,53.25 16.5,51.75 17.25,51 25.75,51 25.75,52 U1.1
MISO_3V3
  Bottom 0.254: X11.7 40.49,101.6 45.19,96.91 U2.8 47.27,96.91 49.28,94.9 49.28,86.58 48.92,86.22 48.92,81.39 49.98,80.33 U5.7
MISO_5V  (via drill 0.61)
  Top 0.254: v27.75,57.5 28.5,58.25 56.75,58.25 v57.25,57.75 | v57.25,80 57.75,79.5 v57.75,76.75 | v2.25,40.5 11.25,31.5 40.75,31.5 41.25,31 51,31 v57.5,37.5
  Bottom 0.254: TP16.P$1 8.75,68 9,67.75 9,64.5 X2.1 9.25,64.25 10,63.5 10,61.5 9.25,60.75 7.5,60.75 7.5,61.25 6.5,62.25 2.75,62.25 2.75,65.75 2,66.5 0,66.5 0,42.75 v2.25,40.5 | v27.75,57.5 28.25,58 28.25,60 26,60 U1.11 | v57.75,76.75 57.75,58.25 v57.25,57.75 57.5,57.5 57.5,44.25 58.5,43.25 58.5,38.5 v57.5,37.5 | v57.25,80 56.5,80 56.25,80.25 55.25,80.25 U5.2
MOSI_3V3  (via drill 0.61)
  Top 0.254: 53.5,98 v51.75,98 | v58.5,91 58.5,93 53.5,98 | 53.5,98 v54,98
  Bottom 0.254: v51.75,98 50.25,99.5 50.25,101.5 45.25,106.5 45.25,112.75 45,113 X11.3 | v54,98 55,97 U2.1 | v58.5,91 58.5,88.75 57.25,88.75 U4.6
MOSI_5V  (via drill 0.61)
  Top 0.254: v24.25,60 24,60.25 v10.75,60.25 | v52.75,92 52.25,92.5 37.5,92.5 32.5,87.5 v30.5,87.5 | v27,84 26.75,83.75 10.5,83.75 3.75,77 3.75,53.75 5.75,53.75 TP17.P$1
  Bottom 0.254: v24.25,60 24.25,59.5 25.75,59.5 U1.10 | v10.75,60.25 10.25,59.75 10.25,58.5 8.75,57 X2.4 8.5,56.75 6,54.25 6,53.75 TP17.P$1 | v52.75,92 55,89.75 55,88.75 54,88.75 U4.3 | v27,84 v30.5,87.5
N$1  (via drill 0.61)
  Top 0.254: v25,101.75 v17.25,101.75
  Bottom 0.254: X1.D+ 26.88,106.68 26.88,104.73 26.41,104.26 26.41,103.7 26.75,103.36 L1.A2 26.75,101.75 v25,101.75 | v17.25,101.75 14.5,101.75 D1.1
N$2  (via drill 0.61)
  Top 0.254: v25,103.25 v15.25,103.25
  Bottom 0.254: X1.D- 26.35,104.85 25.95,104.45 25.95,103.25 | 25.95,103.25 L1.B2 | v15.25,103.25 15.25,103.5 14.5,104.25 D1.6 | 25.95,103.25 v25,103.25
N$3  (via drill 0.61)
  Top 0.254: v25.75,50 26.25,49.5 28,49.5 29.25,48.25 29.25,45.25 v29,45.25 | v39.25,30.5 v31.5,30.5
  Bottom 0.254: C7.P$1 44,60 44,58 FB3.P$2 44.25,58 45.75,56.5 45.75,49.75 47.75,49.75 48,49.5 | v25.75,50 25.75,50.25 27.5,50.25 U1.44 | v29,45.25 27.25,43.5 27.25,34.75 v31.5,30.5 | v39.25,30.5 41,30.5 41.5,31 46,31 46,35.5 46.75,36.25 46.75,40.25 49.25,42.75 49.25,48.25 48,49.5 | 48,49.5 48,63.75 44.5,63.75 42.25,61.5 42.25,59.5 37.5,59.5 U1.24
N$4
  Bottom 0.254: D4.A 3.5,47.25 3.5,51 R18.P$1
N$5
  Bottom 0.254: C1.P$1 41.25,71.5 Y1.2 34.75,69.5 34.75,67.5 34.5,67.25 R6.P$1 34.5,67 34.5,65.75 32.5,63.75 32.5,63.5 31.75,62.75 31.75,62 U1.17
N$6
  Bottom 0.254: 32,66.5 31.5,66 31.5,63.25 30.75,62.5 U1.16 | 32,66.5 32.5,67 R6.P$2 | C2.P$1 22.75,71.5 Y1.1 27.25,71.25 32,66.5
N$7  (via drill 0.61)
  Top 0.254: v18.75,56.5 19.5,57.25 v20.75,57.25
  Bottom 0.254: v18.75,56.5 18.75,58 C8.P$2 | v20.75,57.25 21.5,56.5 24.75,56.5 25,56.25 25.75,56.25 U1.6
N$8
  Bottom 0.254: R2.P$2 12,45.25 8.75,45.25 8.75,45 X3.2
N$9
  Bottom 0.254: R3.P$2 12.25,42.5 9,42.5 X3.3
N$11  (via drill 0.61)
  Top 0.254: v43.75,51.25 54.5,51.25 v60,45.75 | v60,27.25 54,21.25 v38,21.25 | v14.75,49.5 16.25,51 v36.5,51
  Bottom 0.254: v43.75,51.25 43.75,51 44.75,51 R7.P$1 | v60,27.25 61.5,28.75 61.5,44.25 v60,45.75 | v38,21.25 15.5,43.75 15.5,46 14.75,46.75 v14.75,49.5 | v36.5,51 37.25,51.75 37.25,52 U1.33
N$12
  Bottom 0.254: D27.A 3.5,54.25 2,55.75 2,58.5 R13.P$1
N$13
  Bottom 0.254: R8.P$1 44,83 45.75,84.75 S1.2
N$14
  Bottom 0.254: R16.P$1 8.5,63 8.5,62 X2.2
N$15
  Bottom 0.254: R9.P$1 26.25,80.75 26,81 26,84.75 S3.2
N$16
  Bottom 0.254: R10.P$1 47.75,74.5 47.75,73.25 49,72 49,68.25 49.25,68 49.25,66.75 47.5,65 46,65 S4.2
N$17  (via drill 0.61)
  Top 0.254: v16.25,64.75 16.75,64.25 25.25,64.25 25.75,64.75 S5.2
  Bottom 0.254: v16.25,64.75 16.25,65.25 14.75,66.75 14.75,67.5 14.5,67.75 R11.P$1
N$18
  Bottom 0.254: R12.P$1 44.25,42.5 45.75,44 45.75,44.75 S6.2
N$19
  Bottom 0.254: R14.P$1 25,41 25.75,41.75 25.75,44.75 S7.2
N$20  (via drill 0.61)
  Top 0.254: v51.25,26 50.25,25 46,25 S8.2
  Bottom 0.254: v51.25,26 51.25,25.75 52,25 R15.P$1
N$21
  Bottom 0.254: R19.P$1 25,22 25.75,22.75 25.75,24.75 S9.2
N$22
  Bottom 0.254: L1.B1 25.95,100.15 25.58,99.78 R5.P$1
N$23
  Bottom 0.254: L1.A1 26.75,100.15 27.08,99.82 R4.P$1
N$24
  Bottom 0.254: U2.5 R33.P$1
N$25  (via drill 0.61)
  Top 0.254: v18,72.25 17,71.25 v10.5,71.25
  Bottom 0.254: R21.P$1 15,73.5 15,71.5 R17.P$1 15.25,71.5 16.25,70.5 18,70.5 v18,72.25 | v10.5,71.25 9.75,72 9.75,72.75 X14.1
N$26  (via drill 0.61)
  Top 0.254: v16,76.5 15.75,76.25 v7.25,76.25
  Bottom 0.254: 17,76.5 17,77.5 R22.P$1 | 17,76.5 17,75.5 R20.P$1 | v16,76.5 17,76.5 | v7.25,76.25 9.5,76.25 9.5,75.25 X14.2
N$27
  Bottom 0.254: D3.A 1.75,62.5 1.75,65.5 R23.P$1
N$28
  Bottom 0.254: U5.6 49.17,79.67 49,79.5 R24.P$1
N$29
  Bottom 0.254: FB6.P$1 55.25,49 54.25,50 52.75,50 52.75,46.75 54.25,45.25 X15.1
N$30  (via drill 0.61)
  Top 0.254: v49.25,40.5 49.75,40 v51.75,40
  Bottom 0.254: v49.25,40.5 49.25,39 R27.P$1 | v51.75,40 54,37.75 X15.4
N$31  (via drill 0.61)
  Top 0.254: v52,36.5 v45.75,36.5
  Bottom 0.254: v45.75,36.5 R28.P$1 | v52,36.5 54.25,36.5 54.25,35.25 X15.5
N$32  (via drill 0.61)
  Top 0.254: v14.5,79.75 14,79.25 v7.25,79.25
  Bottom 0.254: v14.5,79.75 14.5,81 14.75,81.25 R31.P$1 | v7.25,79.25 8.75,77.75 X14.3
N$36
  Bottom 0.254: X15.2 52.25,42.75 50,45 R25.P$1
N$37  (via drill 0.61)
  Top 0.254: v38.75,40.75 39.25,41.25 48.5,41.25 48.75,41.5 v52,41.5
  Bottom 0.254: v38.75,40.75 38.75,40 39.25,39.5 R26.P$1 | v52,41.5 54.25,41.5 54.25,40.25 X15.3
N$38  (via drill 0.61)
  Top 0.254: v51.75,35 v48.75,35
  Bottom 0.254: v48.75,35 48.75,33.5 R29.P$1 | v51.75,35 54,32.75 X15.6
N$39  (via drill 0.61)
  Top 0.254: v38.25,34.75 40,33 v51.25,33
  Bottom 0.254: v38.25,34.75 38.25,34.25 37.5,33.5 R30.P$1 | v51.25,33 54,30.25 X15.7
RX_LED  (via drill 0.61)
  Top 0.254: v5.25,56.5 6.25,55.5 20.25,55.5 v22.75,58
  Bottom 0.254: v5.25,56.5 5.25,57 3.75,58.5 R13.P$2 | v22.75,58 25.75,58 U1.8
RXD  (via drill 0.61)
  Top 0.254: v15,41.25 22,34.25 35.25,34.25 v36,35 | v36.5,43.5 37.25,44.25 44.75,44.25 45.25,43.75 46.25,43.75 49.25,46.75 v49.25,50.25 | v49,63.5 48.75,63.75 v36.75,63.75
  Bottom 0.254: v15,41.25 15,44.5 14.25,45.25 R2.P$1 | v36,35 36.5,35.5 v36.5,43.5 | v49.25,50.25 49,50.5 v49,63.5 | v36.75,63.75 36,64.5 34.5,64.5 34.5,63.25 34,62.75 34,62 U1.20
SCL_5V  (via drill 0.61)
  Top 0.254: v19.5,73.5 20,74 v23.5,74 | v26,75.25 26,72.75 32.5,66.25 32.5,63.5 v33.5,63.5
  Bottom 0.254: v19.5,73.5 R21.P$2 | v23.5,74 26,74 v26,75.25 | v33.5,63.5 33,63.5 33,63.25 32.5,62.75 32.5,62 U1.18
SDA_5V  (via drill 0.61)
  Top 0.254: v15.75,80.25 16.75,81.25 25.5,81.25 v27,82.75 | v30.5,82.75 32.5,80.75 33.5,80.75 39.5,74.75 40.75,74.75 42.5,76.5 56.25,76.5 62.25,70.5 62.25,59.75 50.75,59.75 50.25,59.25 35.25,59.25 v34,60.5
  Bottom 0.254: v15.75,80.25 15.75,78 15.25,77.5 R22.P$2 | v30.5,82.75 v27,82.75 | v34,60.5 33.25,61.25 33.25,61.75 U1.19
TX_LED  (via drill 0.61)
  Top 0.254: v2.5,50 3,49.5 v8.5,49.5 | v10.75,52.75 11,53 32.25,53 v33.75,54.5
  Bottom 0.254: v2.5,50 2.5,50.25 1.75,51 R18.P$2 | v8.5,49.5 10.75,51.75 v10.75,52.75 | v33.75,54.5 35.5,56.25 35.5,61.75 U1.22
TXD  (via drill 0.61)
  Top 0.254: v13.5,69.5 14.75,70.75 21.5,70.75 v23.5,72.75 | v33.5,66 35.5,64 v35.5,63.5
  Bottom 0.254: v13.5,69.5 13.5,67.25 15,65.75 15,64.25 14.25,63.5 14.25,52.25 13.25,51.25 13.25,43.5 14,42.75 R3.P$1 | v23.5,72.75 24,72.75 24.25,73 33.5,73 v33.5,66 | v35.5,63.5 34.75,62.75 U1.21
USB_D+  (via drill 0.61 pad 1)
  Top 0.254: v28.5,95 29.53,93.97 29.53,86.48 28.96,85.91 28.96,82.81 25,78.85 25,73.05 29.53,68.52 29.53,66.48 29.5,66.45 29.5,62.85 22.57,55.93 v23.5,55
  Bottom 0.254: R4.P$2 27.08,96.42 v28.5,95 | v23.5,55 23.91,54.59 U1.4
USB_D-  (via drill 0.61 pad 1)
  Top 0.254: v26.5,94.5 29.07,91.93 29.07,86.67 28.5,86.1 28.5,83 24.5,79 24.5,72.9 29.07,68.33 29.07,66.67 29,66.6 29,63 v21.5,55.5
  Bottom 0.254: R5.P$2 25.58,95.42 v26.5,94.5 | v21.5,55.5 23.21,53.79 U1.3
USB_GND  (via drill 0.61)
  Top 0.254: 11.5,101.5 v13,103 | v9.25,101.5 11.5,101.5 | v14.75,50.75 14.5,50.5 4.5,50.5 1.5,53.5 1.5,91.75 4.25,91.75 11.5,99 11.5,100.75 | 11.5,101.5 11.5,100.75 | v27.75,55.5 37.75,55.5 38.5,54.75 58,54.75 64.25,61 64.25,99.75 56.5,99.75 53.5,102.75 v28.25,102.75 27.25,102.75 25.25,100.75 11.5,100.75
  Bottom 0.254: v13,103 13,102.25 13.25,102 D1.2 | FB4.P$2 v9.25,101.5 | v14.75,50.75 14.75,56 16.75,58 C8.P$1 | v27.75,55.5 26,55.5 U1.5 | v28.25,102.75 28.25,106.75 X1.GND
USB_VBUS  (via drill 0.61)
  Top 0.254: v22.5,62.25 21,63.75 16,63.75 14.75,65 v14.75,69.5 | v19.25,95.25 v13,89
  Bottom 0.254: X1.VBUS 25.75,106.75 25.75,105.25 23.75,103.25 FB1.P$1 23.5,103 23.5,99.5 v19.25,95.25 | v22.5,62.25 21.75,61.5 21.75,57 U1.7 | v14.75,69.5 13,71.25 v13,89

## Text on the board
Top: TOP LAYER
Bottom: BOTTOM LAYER
Dimension: REV
tPlace: Silkscreen top
bPlace: Silkscreen bottom
tStop: Soldermask top
bStop: Soldermask bottom
tCream: Paste mask top
bCream: Paste mask bottom
Drills: Drill drawing
Milling: Drill tolerance < 2 mm drill | +/- 0.1 mm | Drill tolerance > 2 mm drill | +/- 10 % | General tolerances | IPC | Soldermask color | Silkscreen color | PCB Material | FR4 | Surface finish | HASL | PCB Final thickness (without mask) | 1.6 mm | PCB Build up: | L1: Top | Copper 35 um +/-10 % | FR4 core 1530 um +/-10 % | L2: Bottom | Copper 35 um +/-10 %